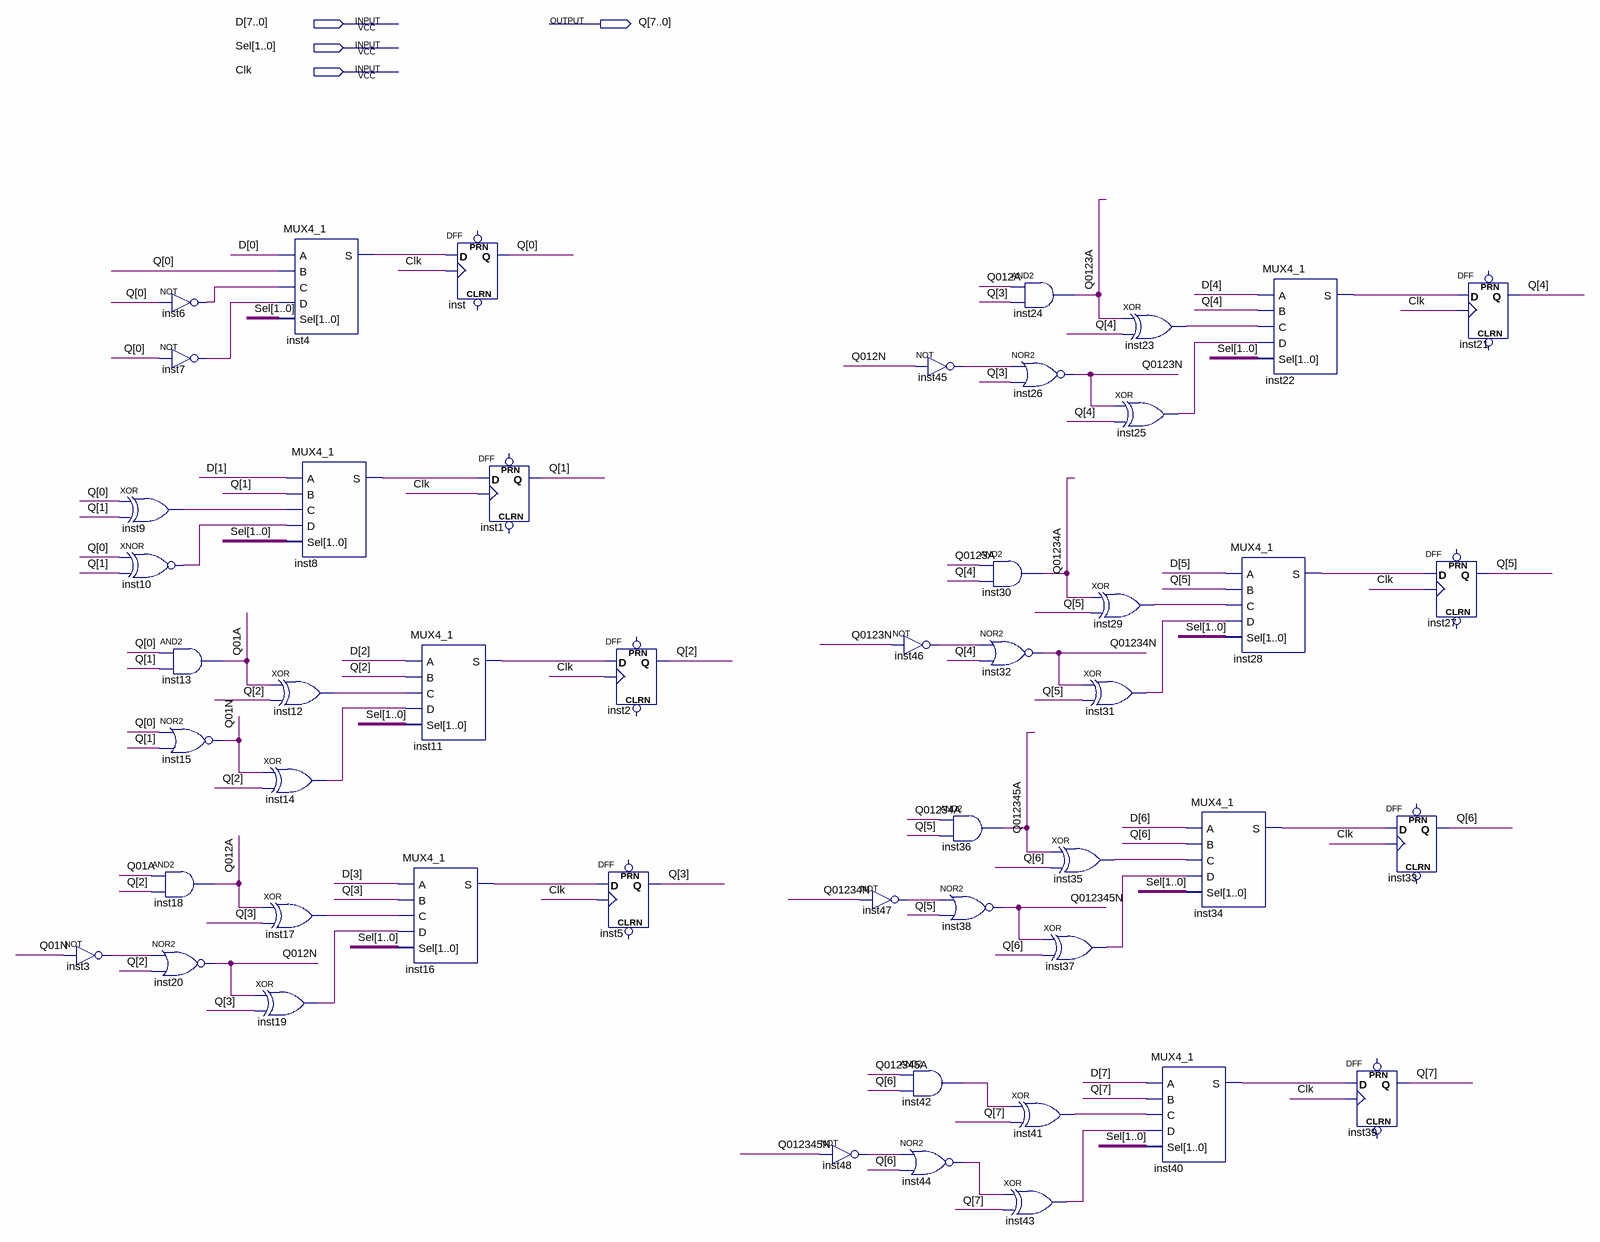
[diagram p0: schematic sheet]
// Quartus schematic SyncCounter8.bdf as structural Verilog: 49 symbols, 4 pins
module SyncCounter8 (
  input  [7:0] D,
  input  [1:0] Sel,
  input  Clk,
  output [7:0] Q
);

  wire inst3_out, inst4_s, inst6_out, inst7_out, inst8_s, inst9_out, inst10_out, inst11_s, inst12_out,
       inst14_out, inst16_s, inst17_out, inst19_out, inst22_s, inst23_out, inst25_out, inst28_s, inst29_out,
       inst31_out, inst34_s, inst35_out, inst37_out, inst40_s, inst41_out, inst42_out, inst43_out,
       inst44_out, inst45_out, inst46_out, inst47_out, inst48_out, Q01A, Q01N, Q012A, Q012N, Q0123A, Q0123N,
       Q01234A, Q01234N, Q012345A, Q012345N;

  not inst3 (inst3_out, Q01N);
  xor inst9 (inst9_out, Q[0], Q[1]);
  xnor inst10 (inst10_out, Q[0], Q[1]);
  not inst6 (inst6_out, Q[0]);
  not inst7 (inst7_out, Q[0]);
  and inst13 (Q01A, Q[0], Q[1]);
  nor inst15 (Q01N, Q[0], Q[1]);
  and inst18 (Q012A, Q01A, Q[2]);
  nor inst20 (Q012N, inst3_out, Q[2]);
  xor inst19 (inst19_out, Q012N, Q[3]);
  MUX4_1 inst4 (.A(D[0]), .B(Q[0]), .C(inst6_out), .D(inst7_out), .Sel(Sel), .S(inst4_s));
  MUX4_1 inst8 (.A(D[1]), .B(Q[1]), .C(inst9_out), .D(inst10_out), .Sel(Sel), .S(inst8_s));
  xor inst12 (inst12_out, Q01A, Q[2]);
  xor inst14 (inst14_out, Q01N, Q[2]);
  xor inst17 (inst17_out, Q012A, Q[3]);
  DFF inst (.CLK(Clk), .D(inst4_s), .Q(Q[0]));  // open: CLRN, PRN
  MUX4_1 inst11 (.A(D[2]), .B(Q[2]), .C(inst12_out), .D(inst14_out), .Sel(Sel), .S(inst11_s));
  MUX4_1 inst16 (.A(D[3]), .B(Q[3]), .C(inst17_out), .D(inst19_out), .Sel(Sel), .S(inst16_s));
  DFF inst1 (.CLK(Clk), .D(inst8_s), .Q(Q[1]));  // open: CLRN, PRN
  DFF inst2 (.CLK(Clk), .D(inst11_s), .Q(Q[2]));  // open: CLRN, PRN
  DFF inst5 (.CLK(Clk), .D(inst16_s), .Q(Q[3]));  // open: CLRN, PRN
  not inst48 (inst48_out, Q012345N);
  not inst46 (inst46_out, Q0123N);
  not inst47 (inst47_out, Q01234N);
  not inst45 (inst45_out, Q012N);
  and inst36 (Q012345A, Q01234A, Q[5]);
  nor inst38 (Q012345N, inst47_out, Q[5]);
  and inst42 (inst42_out, Q012345A, Q[6]);
  nor inst44 (inst44_out, inst48_out, Q[6]);
  and inst24 (Q0123A, Q012A, Q[3]);
  nor inst26 (Q0123N, inst45_out, Q[3]);
  and inst30 (Q01234A, Q0123A, Q[4]);
  nor inst32 (Q01234N, inst46_out, Q[4]);
  xor inst41 (inst41_out, inst42_out, Q[7]);
  xor inst43 (inst43_out, inst44_out, Q[7]);
  xor inst31 (inst31_out, Q01234N, Q[5]);
  xor inst35 (inst35_out, Q012345A, Q[6]);
  xor inst37 (inst37_out, Q012345N, Q[6]);
  xor inst23 (inst23_out, Q0123A, Q[4]);
  xor inst25 (inst25_out, Q0123N, Q[4]);
  xor inst29 (inst29_out, Q01234A, Q[5]);
  MUX4_1 inst40 (.A(D[7]), .B(Q[7]), .C(inst41_out), .D(inst43_out), .Sel(Sel), .S(inst40_s));
  MUX4_1 inst34 (.A(D[6]), .B(Q[6]), .C(inst35_out), .D(inst37_out), .Sel(Sel), .S(inst34_s));
  MUX4_1 inst22 (.A(D[4]), .B(Q[4]), .C(inst23_out), .D(inst25_out), .Sel(Sel), .S(inst22_s));
  MUX4_1 inst28 (.A(D[5]), .B(Q[5]), .C(inst29_out), .D(inst31_out), .Sel(Sel), .S(inst28_s));
  DFF inst33 (.CLK(Clk), .D(inst34_s), .Q(Q[6]));  // open: CLRN, PRN
  DFF inst39 (.CLK(Clk), .D(inst40_s), .Q(Q[7]));  // open: CLRN, PRN
  DFF inst21 (.CLK(Clk), .D(inst22_s), .Q(Q[4]));  // open: CLRN, PRN
  DFF inst27 (.CLK(Clk), .D(inst28_s), .Q(Q[5]));  // open: CLRN, PRN
endmodule
